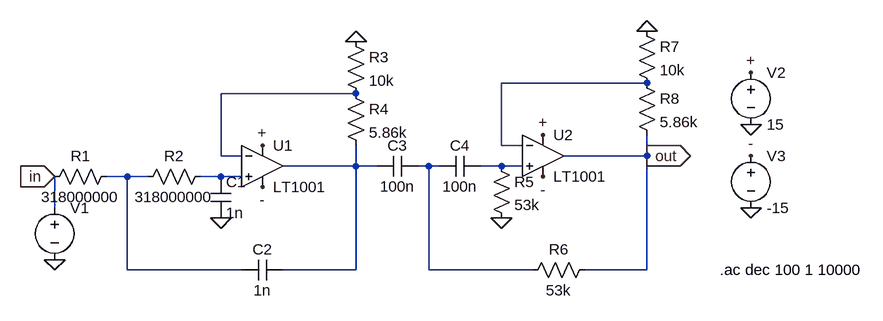
[diagram p0: schematic DesignDeltaFilter.asc]
DesignDeltaFilter.asc, the LTspice schematic file:
Version 4
SHEET 1 900 688
WIRE 208 320 -16 320
WIRE -240 336 -448 336
WIRE -16 416 -16 320
WIRE 16 416 -16 416
WIRE -448 432 -448 336
WIRE -416 432 -448 432
WIRE 208 432 208 400
WIRE 208 432 80 432
WIRE -240 448 -240 416
WIRE -240 448 -352 448
WIRE -208 448 -240 448
WIRE -128 448 -144 448
WIRE -112 448 -128 448
WIRE -16 448 -48 448
WIRE 16 448 -16 448
WIRE -592 464 -624 464
WIRE -560 464 -592 464
WIRE -448 464 -480 464
WIRE -416 464 -448 464
WIRE -704 512 -704 464
WIRE -592 608 -592 464
WIRE -416 608 -592 608
WIRE -240 608 -240 448
WIRE -240 608 -352 608
WIRE -128 608 -128 448
WIRE 32 608 -128 608
WIRE 208 608 208 432
WIRE 208 608 112 608
FLAG -704 592 0
FLAG -448 528 0
FLAG -240 256 0
FLAG -16 528 0
FLAG 208 240 0
FLAG 48 400 +
FLAG -384 416 +
FLAG 48 464 -
FLAG -384 480 -
FLAG 368 432 -
FLAG 368 304 +
FLAG 368 512 0
FLAG 368 384 0
FLAG -704 464 in
IOPIN -704 464 In
FLAG 208 432 out
IOPIN 208 432 Out
SYMBOL voltage -704 496 R0
SYMATTR InstName V1
SYMATTR Value ""
SYMATTR Value2 AC 1
SYMBOL res -608 448 R90
WINDOW 0 0 56 VBottom 2
WINDOW 3 32 56 VTop 2
SYMATTR InstName R1
SYMATTR Value 318000000
SYMBOL res -464 448 R90
WINDOW 0 0 56 VBottom 2
WINDOW 3 32 56 VTop 2
SYMATTR InstName R2
SYMATTR Value 318000000
SYMBOL OpAmps/LT1001 -384 384 R0
SYMATTR InstName U1
SYMBOL OpAmps/LT1001 48 368 R0
SYMATTR InstName U2
SYMBOL cap -464 464 R0
SYMATTR InstName C1
SYMATTR Value 1n
SYMBOL cap -352 592 R90
WINDOW 0 0 32 VBottom 2
WINDOW 3 32 32 VTop 2
SYMATTR InstName C2
SYMATTR Value 1n
SYMBOL res -256 240 R0
SYMATTR InstName R3
SYMATTR Value 10k
SYMBOL res -256 320 R0
SYMATTR InstName R4
SYMATTR Value 5.86k
SYMBOL cap -144 432 R90
WINDOW 0 0 32 VBottom 2
WINDOW 3 32 32 VTop 2
SYMATTR InstName C3
SYMATTR Value 100n
SYMBOL cap -48 432 R90
WINDOW 0 0 32 VBottom 2
WINDOW 3 32 32 VTop 2
SYMATTR InstName C4
SYMATTR Value 100n
SYMBOL res -32 432 R0
SYMATTR InstName R5
SYMATTR Value 53k
SYMBOL res 128 592 R90
WINDOW 0 0 56 VBottom 2
WINDOW 3 32 56 VTop 2
SYMATTR InstName R6
SYMATTR Value 53k
SYMBOL res 192 224 R0
SYMATTR InstName R7
SYMATTR Value 10k
SYMBOL res 192 304 R0
SYMATTR InstName R8
SYMATTR Value 5.86k
SYMBOL voltage 368 288 R0
SYMATTR InstName V2
SYMATTR Value 15
SYMBOL voltage 368 416 R0
SYMATTR InstName V3
SYMATTR Value -15
TEXT 320 608 Left 2 !.ac dec 100 1 10000

The netlist it stands for:
* DesignDeltaFilter.asc
V1 in 0 AC 1
R1 N006 in 318000000
R2 N007 N006 318000000
XU1 N007 N002 + - N003 LT1001  ; pins In+ In- V+ V- OUT
XU2 N005 N001 + - out LT1001  ; pins In+ In- V+ V- OUT
C1 N007 0 1n
C2 N003 N006 1n
R3 0 N002 10k
R4 N002 N003 5.86k
C3 N004 N003 100n
C4 N005 N004 100n
R5 N005 0 53k
R6 out N004 53k
R7 0 N001 10k
R8 N001 out 5.86k
V2 + 0 15
V3 - 0 -15
.ac dec 100 1 10000
.lib LTC.lib
.backanno
.end